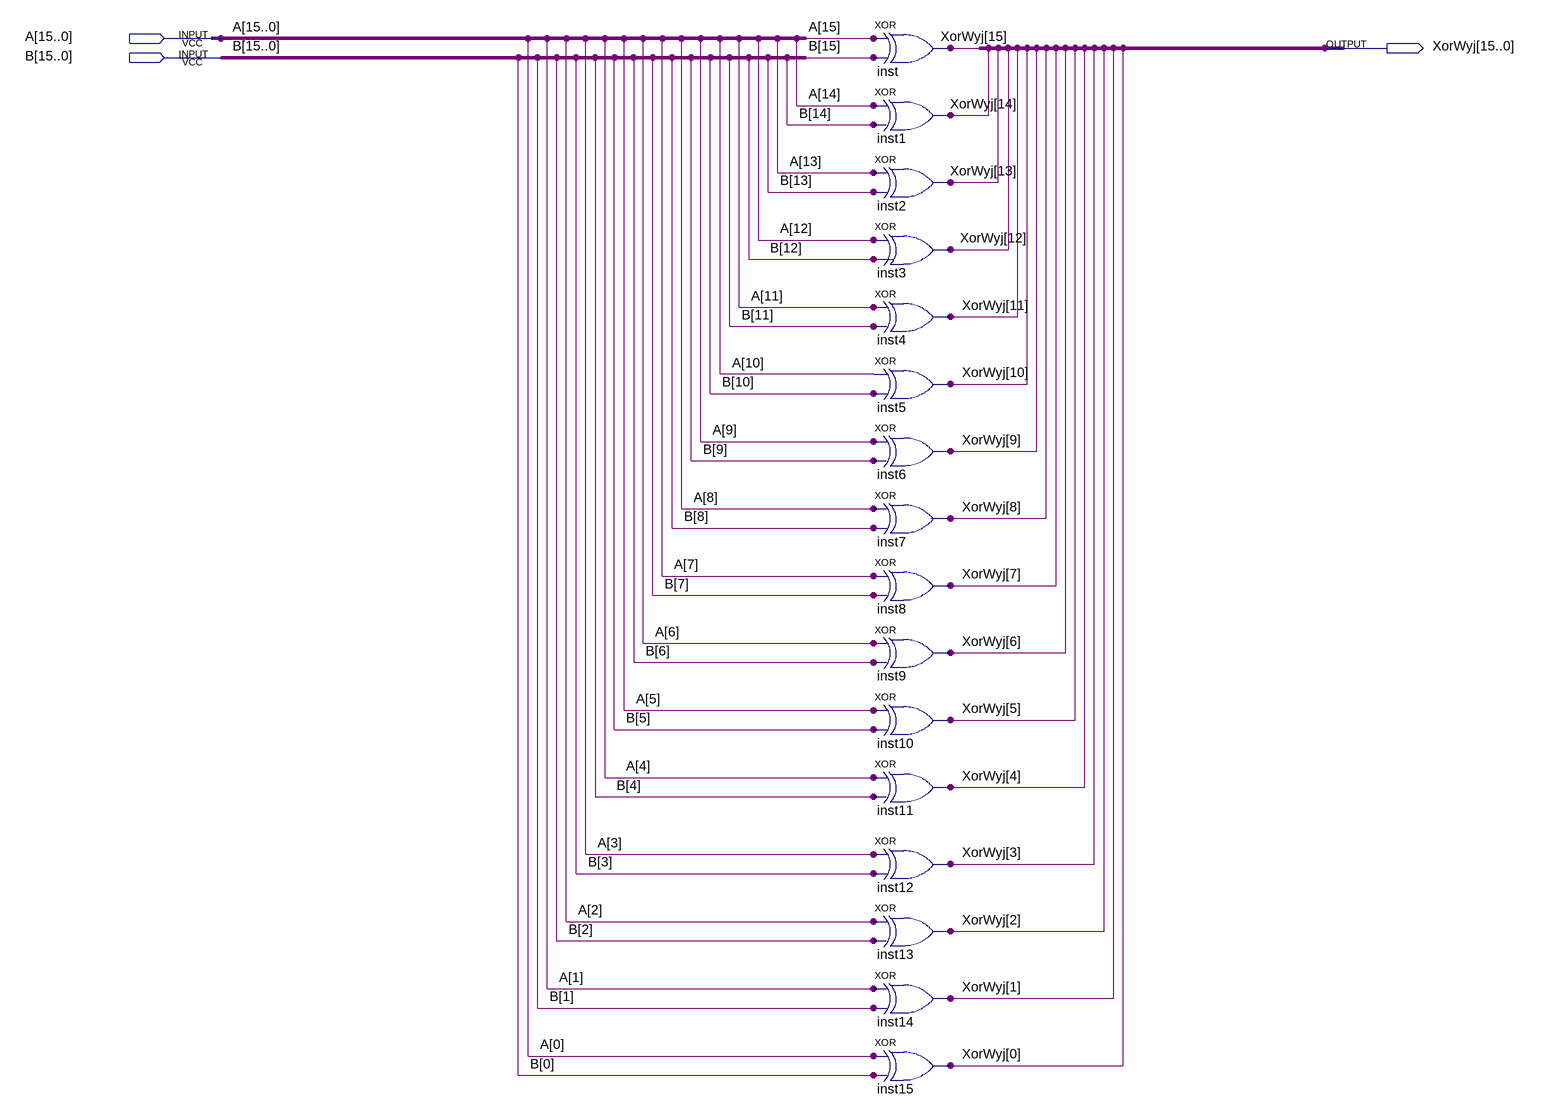
[diagram p0: schematic sheet]
// Quartus schematic xorvector.bdf as structural Verilog: 16 symbols, 3 pins
module xorvector (
  input  [15:0] A,
  input  [15:0] B,
  output [15:0] XorWyj
);

  xor inst (XorWyj[15], A[15], B[15]);
  xor inst1 (XorWyj[14], A[14], B[14]);
  xor inst2 (XorWyj[13], A[13], B[13]);
  xor inst3 (XorWyj[12], A[12], B[12]);
  xor inst4 (XorWyj[11], A[11], B[11]);
  xor inst5 (XorWyj[10], A[10], B[10]);
  xor inst6 (XorWyj[9], A[9], B[9]);
  xor inst7 (XorWyj[8], A[8], B[8]);
  xor inst8 (XorWyj[7], A[7], B[7]);
  xor inst9 (XorWyj[6], A[6], B[6]);
  xor inst10 (XorWyj[5], A[5], B[5]);
  xor inst11 (XorWyj[4], A[4], B[4]);
  xor inst12 (XorWyj[3], A[3], B[3]);
  xor inst13 (XorWyj[2], A[2], B[2]);
  xor inst14 (XorWyj[1], A[1], B[1]);
  xor inst15 (XorWyj[0], A[0], B[0]);
endmodule
